# EAGLE design xv11_lidar_controller (EAGLE 7.3.0)

## Sheet 1 of 2: MAIN
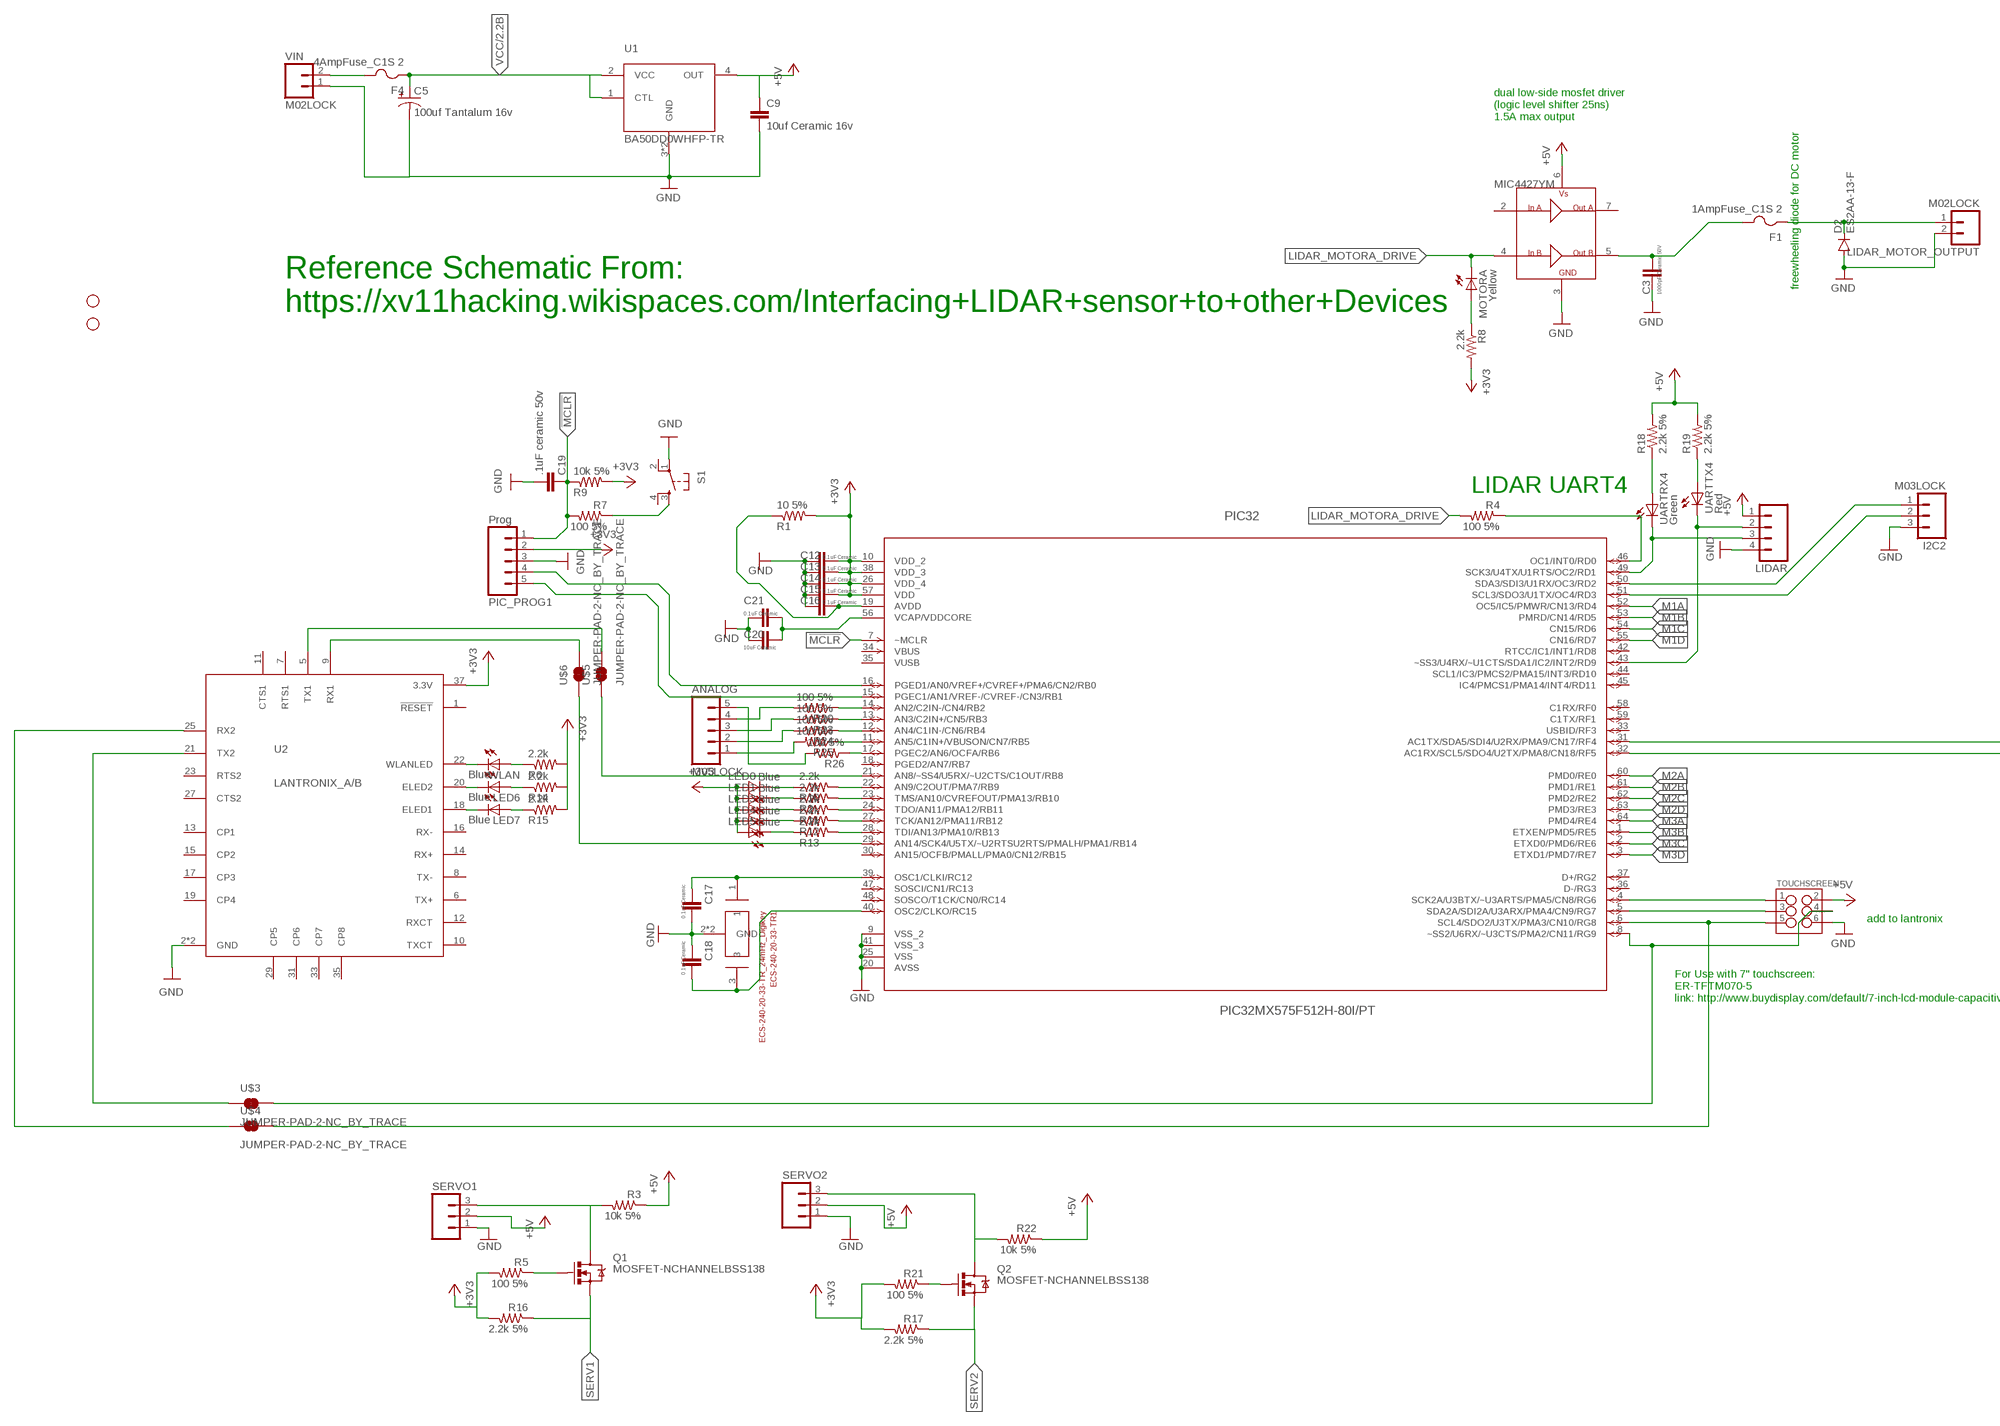
[diagram p0: schematic, sheet 1, part 1 of 2]
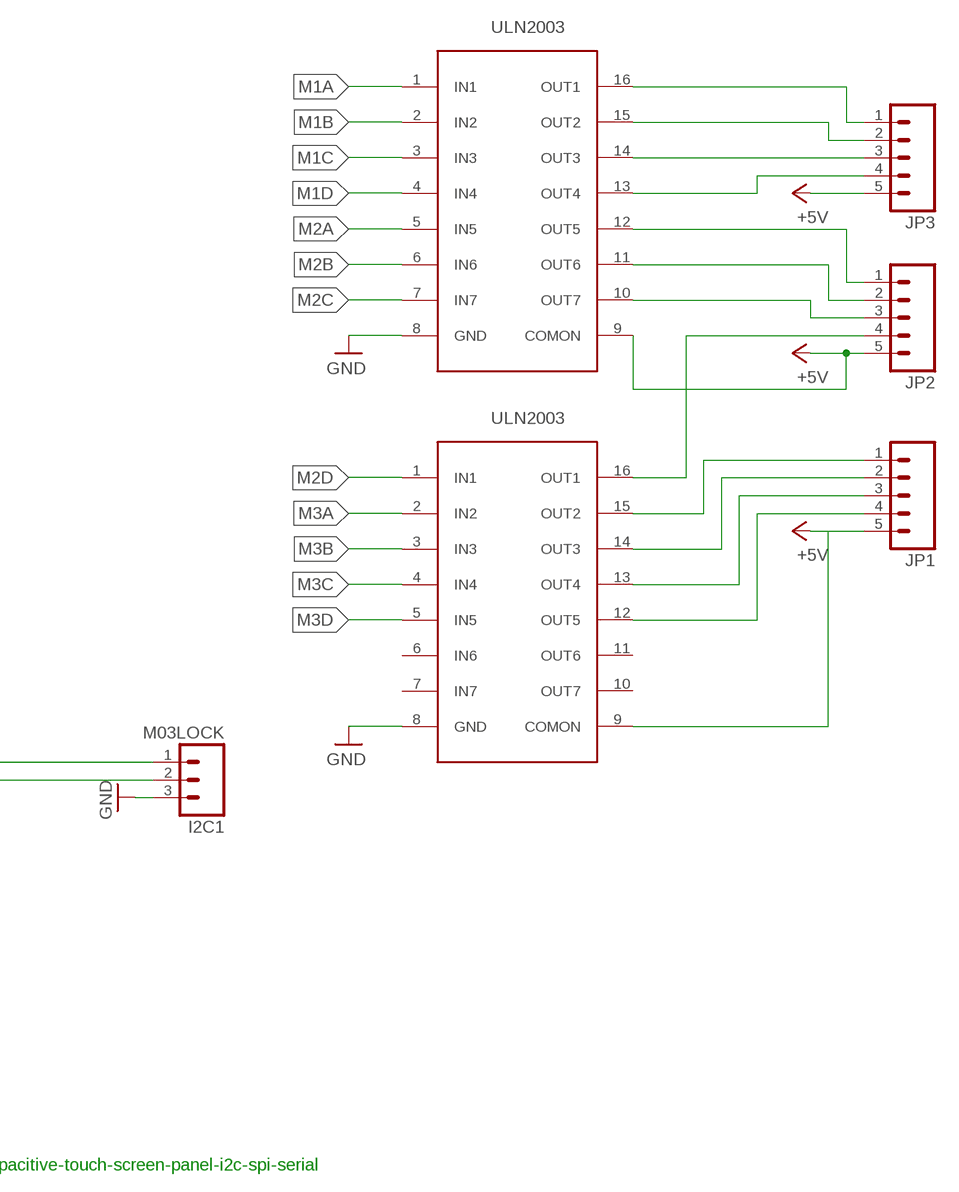
[diagram p1: schematic, sheet 1, part 2 of 2]

### Parts
ANALOG  M05LOCK  [1X05_LOCK]
C3  1000pF Ceramic 50V  CAP0805  [0805]
C5  100uf Tantalum 16v  CAP_POL1206  [EIA3216]
C9  10uf Ceramic 16v  CAP0805  [0805]
C12  0.1uF Ceramic  CAP0805  [0805]
C13  0.1uF Ceramic  CAP0805  [0805]
C14  0.1uF Ceramic  CAP0805  [0805]
C15  0.1uF Ceramic  CAP0805  [0805]
C16  0.1uF Ceramic  CAP0805  [0805]
C17  0.1uF Ceramic  CAP0805  [0805]
C18  0.1uF Ceramic  CAP0805  [0805]
C19  .1uF ceramic 50v  1UF-25V-10%(0805)  [0805]
C20  10uF Ceramic  CAP0805  [0805]
C21  0.1uF Ceramic  CAP0805  [0805]
D2  ES2AA-13-F  DIODESMA  [SMA-DIODE]
ECS-240-20-33-TR1  ECS-240-20-33-TR_24mHz_Digikey  CRYSTAL  [ECX-32]
F1  1AmpFuse_C1S 2  PTCFUSE-1206  [R1206]
F4  4AmpFuse_C1S 2  PTCFUSE-1206  [R1206]
I2C1  M03LOCK  [1X03_LOCK]
I2C2  M03LOCK  [1X03_LOCK]
JP1  M05LOCK  [1X05_LOCK]
JP2  M05LOCK  [1X05_LOCK]
JP3  M05LOCK  [1X05_LOCK]
LED0  Blue  LEDCHIP-LED0805  [CHIP-LED0805]
LED1  Blue  LEDCHIP-LED0805  [CHIP-LED0805]
LED3  Blue  LEDCHIP-LED0805  [CHIP-LED0805]
LED4  Blue  LEDCHIP-LED0805  [CHIP-LED0805]
LED5  Blue  LEDCHIP-LED0805  [CHIP-LED0805]
LED6  Blue  LEDCHIP-LED0805  [CHIP-LED0805]
LED7  Blue  LEDCHIP-LED0805  [CHIP-LED0805]
LIDAR  M04LOCK  [1X04_LOCK]
LIDAR_MOTOR_OUTPUT  M02LOCK  [1X02_LOCK]
MOTORA  Yellow  LEDCHIP-LED0805  [CHIP-LED0805]
PIC32  PIC32MX575F512H-80I/PT  [QFP50P1200X1200X120-64N]
PIC_PROG1  Prog  M05LOCK_LONGPADS  [1X05_LOCK_LONGPADS]
Q1  MOSFET-NCHANNELBSS138  [SOT23]
Q2  MOSFET-NCHANNELBSS138  [SOT23]
R1  10 5%  R-US_R0805  [R0805]
R2  2.2k  R-US_R0805  [R0805]
R3  10k 5%  R-US_R0805  [R0805]
R4  100 5%  R-US_M0805  [M0805]
R5  100 5%  R-US_R0805  [R0805]
R6  2.2k  R-US_R0805  [R0805]
R7  100 5%  R-US_R0805  [R0805]
R8  2.2k  R-US_M0805  [M0805]
R9  10k 5%  R-US_R0805  [R0805]
R10  2.2k  R-US_R0805  [R0805]
R11  2.2k  R-US_R0805  [R0805]
R12  2.2k  R-US_R0805  [R0805]
R13  2.2k  R-US_R0805  [R0805]
R14  2.2k  R-US_R0805  [R0805]
R15  2.2k  R-US_R0805  [R0805]
R16  2.2k 5%  R-US_R0805  [R0805]
R17  2.2k 5%  R-US_R0805  [R0805]
R18  2.2k 5%  R-US_M0805  [M0805]
R19  2.2k 5%  R-US_M0805  [M0805]
R20  100 5%  R-US_R0805  [R0805]
R21  100 5%  R-US_R0805  [R0805]
R22  10k 5%  R-US_R0805  [R0805]
R23  100 5%  R-US_R0805  [R0805]
R24  100 5%  R-US_R0805  [R0805]
R25  100 5%  R-US_R0805  [R0805]
R26  100 5%  R-US_R0805  [R0805]
S1  TAC_SWITCHSMD  [TACTILE-SWITCH-SMD]
SERVO1  M03PTH  [1X03]
SERVO2  M03PTH  [1X03]
STANDOFF1  STAND-OFF  [STAND-OFF]
STANDOFF2  STAND-OFF  [STAND-OFF]
TOUCHSCREEN  M03X2NO_SILK  [2X3-NS]
U1  BA50DD0WHFP-TR  [HRP5]
U2  LANTRONIX_A/B  [LANA/BTH]
U3  MIC4427YM  [SO-08]
U$1  ULN2003  [SOIC16_3.9WIDE]
U$2  ULN2003  [SOIC16_3.9WIDE]
U$3  JUMPER-PAD-2-NC_BY_TRACE  [PAD-JUMPER-2-NC_BY_TRACE_YES_SILK]
U$4  JUMPER-PAD-2-NC_BY_TRACE  [PAD-JUMPER-2-NC_BY_TRACE_YES_SILK]
U$5  JUMPER-PAD-2-NC_BY_TRACE  [PAD-JUMPER-2-NC_BY_TRACE_YES_SILK]
U$6  JUMPER-PAD-2-NC_BY_TRACE  [PAD-JUMPER-2-NC_BY_TRACE_YES_SILK]
UARTRX4  Green  LEDCHIP-LED0805  [CHIP-LED0805]
UARTTX4  Red  LEDCHIP-LED0805  [CHIP-LED0805]
VIN  M02LOCK  [1X02_LOCK]
WLAN  Blue  LEDCHIP-LED0805  [CHIP-LED0805]

### Nets
!MCLR: C19.1 PIC32.7(~MCLR) PIC_PROG1.1 R7.2 R9.1
+3V3: C12.2 C13.2 C14.2 C15.2 LED0.A LED1.A LED3.A LED4.A LED5.A PIC32.10(VDD_2) PIC32.26(VDD_4) PIC32.38(VDD_3) PIC32.57(VDD) PIC_PROG1.2 R1.2 R5.2 R6.2 R8.2 R9.2 R14.2 R15.2 R16.2 R17.2 R21.2 U2.37(3.3V) ; also sheet 2
+5V: C9.1 JP1.5 JP2.5 JP3.5 LIDAR.1 R3.1 R18.2 R19.2 R22.1 SERVO1.2 SERVO2.2 TOUCHSCREEN.2 U1.4(OUT) U3.6(VS) U$1.9(COMON) U$2.9(COMON)
GND: C3.1 C5.C(-) C9.2 C12.1 C13.1 C14.1 C15.1 C16.1 C17.2 C18.1 C19.2 C20.1 C21.1 D2.A ECS-240-20-33-TR1.2(GND) ECS-240-20-33-TR1.4(GND) I2C1.3 I2C2.3 LIDAR.4 LIDAR_MOTOR_OUTPUT.2 PIC32.9(VSS_2) PIC32.20(AVSS) PIC32.25(VSS) PIC32.41(VSS_3) PIC_PROG1.3 S1.1 SERVO1.1 SERVO2.1 TOUCHSCREEN.6 U1.3(GND) U1.G(GND) U2.2(GND) U2.39(GND) U3.3(GND) U$1.8(GND) U$2.8(GND) VIN.1 ; also sheet 2
LIDAR_MOTOR_OUTPUT: D2.C F1.1 LIDAR_MOTOR_OUTPUT.1
LIDAR_MOTORA_DRIVE: MOTORA.C R4.2 U3.4(INB)
M1A: PIC32.52(OC5/IC5/PMWR/CN13/RD4) U$1.1(IN1)
M1B: PIC32.53(PMRD/CN14/RD5) U$1.2(IN2)
M1C: PIC32.54(CN15/RD6) U$1.3(IN3)
M1D: PIC32.55(CN16/RD7) U$1.4(IN4)
M2A: PIC32.60(PMD0/RE0) U$1.5(IN5)
M2B: PIC32.61(PMD1/RE1) U$1.6(IN6)
M2C: PIC32.62(PMD2/RE2) U$1.7(IN7)
M2D: PIC32.63(PMD3/RE3) U$2.1(IN1)
M3A: PIC32.64(PMD4/RE4) U$2.2(IN2)
M3B: PIC32.1(ETXEN/PMD5/RE5) U$2.3(IN3)
M3C: PIC32.2(ETXD0/PMD6/RE6) U$2.4(IN4)
M3D: PIC32.3(ETXD1/PMD7/RE7) U$2.5(IN5)
N1: PIC32.22(AN9/C2OUT/PMA7/RB9) R10.2
N2: PIC32.23(TMS/AN10/CVREFOUT/PMA13/RB10) R2.2
N$1: U2.25(RX2) U$4.1
N$2: ANALOG.1 R25.2
N$3: ANALOG.2 R24.2
N$4: C3.2 F1.2 U3.5(OUTB)
N$5: PIC32.46(OC1/INT0/RD0) R4.1
N$6: PIC32.14(AN2/C2IN-/CN4/RB2) R20.1
N$7: U2.21(TX2) U$3.1
N$8: R18.1 UARTRX4.A
N$9: ANALOG.3 R23.2
N$10: PIC32.13(AN3/C2IN+/CN5/RB3) R23.1
N$11: C17.1 ECS-240-20-33-TR1.1 PIC32.39(OSC1/CLKI/RC12)
N$12: C18.2 ECS-240-20-33-TR1.3 PIC32.40(OSC2/CLKO/RC15)
N$13: PIC32.12(AN4/C1IN-/CN6/RB4) R24.1
N$14: PIC32.11(AN5/C1IN+/VBUSON/CN7/RB5) R25.1
N$15: ANALOG.4 R20.2
N$16: C16.2 PIC32.19(AVDD) R1.1
N$17: C20.2 C21.2 PIC32.56(VCAP/VDDCORE)
N$18: Q1.3(D) R3.2 SERVO1.3
N$19: PIC32.16(PGED1/AN0/VREF+/CVREF+/PMA6/CN2/RB0) PIC_PROG1.4
N$20: LED0.C R10.1
N$21: PIC32.8(~SS2/U6RX/~U3CTS/PMA2/CN11/RG9) TOUCHSCREEN.4 U$3.2
N$22: LED1.C R2.1
N$23: R7.1 S1.3
N$24: LED3.C R11.1
N$25: Q2.3(D) R22.2 SERVO2.3
N$26: Q1.1(G) R5.1
N$27: Q2.1(G) R21.1
N$29: LIDAR.3 PIC32.49(SCK3/U4TX/U1RTS/OC2/RD1) UARTRX4.C
N$30: LIDAR.2 PIC32.43(~SS3/U4RX/~U1CTS/SDA1/IC2/INT2/RD9) UARTTX4.C
N$31: MOTORA.A R8.1
N$33: PIC32.24(TDO/AN11/PMA12/RB11) R11.2
N$36: PIC32.17(PGEC2/AN6/OCFA/RB6) R26.1
N$37: ANALOG.5 R26.2
N$39: U2.9(RX1) U$6.2
N$40: PIC32.21(AN8/~SS4/U5RX/~U2CTS/C1OUT/RB8) U$5.1
N$43: R19.1 UARTTX4.A
N$48: F4.2 VIN.2
N$51: JP3.1 U$1.16(OUT1)
N$52: JP3.2 U$1.15(OUT2)
N$53: JP3.3 U$1.14(OUT3)
N$54: JP3.4 U$1.13(OUT4)
N$55: JP2.1 U$1.12(OUT5)
N$56: JP2.2 U$1.11(OUT6)
N$57: JP2.3 U$1.10(OUT7)
N$58: JP2.4 U$2.16(OUT1)
N$59: JP1.1 U$2.15(OUT2)
N$60: JP1.2 U$2.14(OUT3)
N$61: JP1.3 U$2.13(OUT4)
N$62: JP1.4 U$2.12(OUT5)
N$63: U2.5(TX1) U$5.2
N$64: I2C2.1 PIC32.50(SDA3/SDI3/U1RX/OC3/RD2)
N$65: I2C2.2 PIC32.51(SCL3/SDO3/U1TX/OC4/RD3)
N$66: PIC32.29(AN14/SCK4/U5TX/~U2RTSU2RTS/PMALH/PMA1/RB14) U$6.1
N$67: U2.22(WLANLED) WLAN.C
N$68: LED6.C U2.20(ELED2)
N$69: LED7.C U2.18(ELED1)
N$70: LED7.A R15.1
N$71: LED6.A R14.1
N$72: R6.1 WLAN.A
ONE: LED5.C R13.1
PIC_HANG_CHK: PIC32.15(PGEC1/AN1/VREF-/CVREF-/CN3/RB1) PIC_PROG1.5
PICUART_RX: I2C1.1 PIC32.31(AC1TX/SDA5/SDI4/U2RX/PMA9/CN17/RF4)
PICUART_TX: I2C1.2 PIC32.32(AC1RX/SCL5/SDO4/U2TX/PMA8/CN18/RF5)
SCK2: PIC32.4(SCK2A/U3BTX/~U3ARTS/PMA5/CN8/RG6) TOUCHSCREEN.1
SDI2: PIC32.5(SDA2A/SDI2A/U3ARX/PMA4/CN9/RG7) TOUCHSCREEN.3
SDO2: PIC32.6(SCL4/SDO2/U3TX/PMA3/CN10/RG8) TOUCHSCREEN.5 U$4.2
SERV1: PIC32.28(TDI/AN13/PMA10/RB13) Q1.2(S) R13.2 R16.1
SERV2: PIC32.27(TCK/AN12/PMA11/RB12) Q2.2(S) R12.2 R17.1
TWO: LED4.C R12.1
VCC: C5.A(+) F4.1 U1.1(CTL) U1.2(VCC) ; also sheet 2
Unconnected: PIC32.18(PGED2/AN7/RB7) PIC32.30(AN15/OCFB/PMALL/PMA0/CN12/RB15) PIC32.33(USBID/RF3) PIC32.34(VBUS) PIC32.36(D-/RG3) PIC32.37(D+/RG2) PIC32.42(RTCC/IC1/INT1/RD8) PIC32.44(SCL1/IC3/PMCS2/PMA15/INT3/RD10) PIC32.45(IC4/PMCS1/PMA14/INT4/RD11) PIC32.47(SOSCI/CN1/RC13) PIC32.48(SOSCO/T1CK/CN0/RC14) PIC32.58(C1RX/RF0) PIC32.59(C1TX/RF1) S1.2 S1.4 U2.1(!RESET) U2.6(TX+) U2.7(RTS1) U2.8(TX-) U2.10(TXCT) U2.11(CTS1) U2.12(RXCT) U2.13(CP1) U2.14(RX+) U2.15(CP2) U2.16(RX-) U2.17(CP3) U2.19(CP4) U2.23(RTS2) U2.27(CTS2) U2.29(CP5) U2.31(CP6) U2.33(CP7) U2.35(CP8) U3.2(INA) U3.7(OUTA) U$2.6(IN6) U$2.7(IN7) U$2.10(OUT7) U$2.11(OUT6)

### Notes on the sheet
- dual low-side mosfet driver
  (logic level shifter 25ns)
  1.5A max output
- freewheeling diode for DC motor
- Reference Schematic From:
  https://xv11hacking.wikispaces.com/Interfacing+LIDAR+sensor+to+other+Devices
- LIDAR UART4
- add to lantronix
- For Use with 7" touchscreen:
  ER-TFTM070-5
  link: http://www.buydisplay.com/default/7-inch-lcd-module-capacitive-touch-screen-panel-i2c-spi-serial

## Sheet 2 of 2: POWER
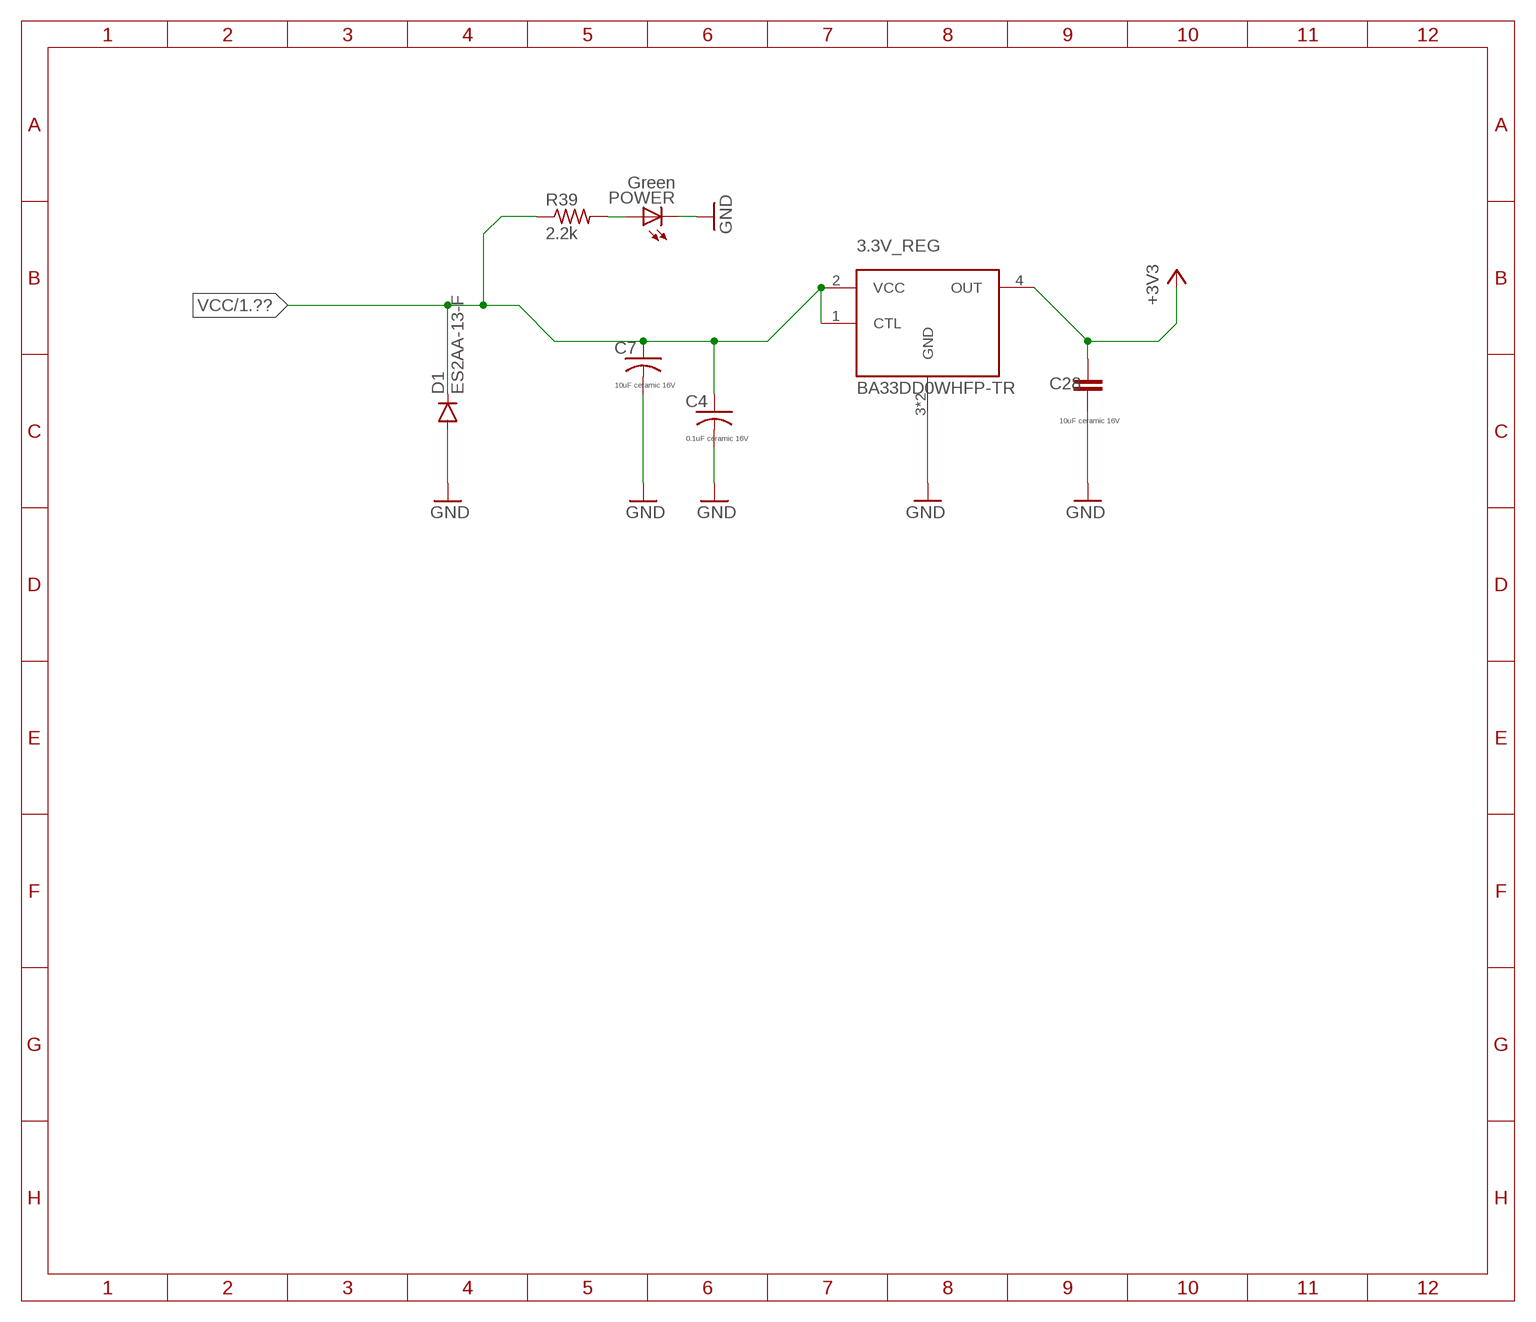
[diagram p2: schematic, sheet 2]

### Parts
3.3V_REG  BA33DD0WHFP-TR  BA50DD0WHFP-TR  [HRP5]
C4  0.1uF ceramic 16V  C-USC0805K  [C0805K]
C7  10uF ceramic 16V  C-USC0805K  [C0805K]
C28  10uF ceramic 16V  CAP0805  [0805]
D1  ES2AA-13-F  DIODESMA  [SMA-DIODE]
POWER  Green  LEDCHIP-LED0805  [CHIP-LED0805]
R39  2.2k  R-US_R0805  [R0805]

### Nets
+3V3: 3.3V_REG.4(OUT) C28.1 ; also sheet 1
GND: 3.3V_REG.3(GND) 3.3V_REG.G(GND) C4.2 C7.2 C28.2 D1.A POWER.C ; also sheet 1
N$50: POWER.A R39.2
VCC: 3.3V_REG.1(CTL) 3.3V_REG.2(VCC) C4.1 C7.1 D1.C R39.1 ; also sheet 1

## Power pins joined to a net without a drawn wire
VUSB: PIC32.35(VUSB)

## Library data of the parts
3.3V_REG U1 = NASA_LIB:BA50DD0WHFP-TR
ANALOG JP1-JP3 PIC_PROG1 = SparkFun-Connectors:M05: Header 5 Standard 5-pin 0.1" header. Use with straight break away headers (SKU : PRT-00116), right angle break away headers (PRT-00553), swiss pins (PRT-00743), machine pins (PRT-00117), and female headers (PRT-00115). Molex polarized connector foot print use with SKU : PRT-08230 with associated crimp pins and housings.
C3 C9 C12-C18 C20 C21 C28 = SparkFun-Capacitors:CAP: Capacitor Standard 0603 ceramic capacitor, and 0.1" leaded capacitor.
C4 C7 = adafruit:C-US: CAPACITOR, American symbol
C5 = SparkFun-Capacitors:CAP_POL: Capacitor Polarized These are standard SMD and PTH capacitors. Normally 10uF, 47uF, and 100uF in electrolytic and tantalum varieties. Always verify the external diameter of the through hole cap, it varies with capacity, voltage, and manufacturer. The EIA devices should be standard.
C19 = SparkFun-Capacitors:1UF-25V-10%(0805): CAP-08064; PROD_ID: CAP-08064; VALUE: 1uF
D1 D2 = SparkFun-DiscreteSemi:DIODE: Diode These are standard reverse protection diodes and small signal diodes. SMA package can handle up to about 1A. SOD-323 can handle about 200mA. What the SOD-323 package when ordering, there are some mfgs out there that are 5-pin packages.
ECS-240-20-33-TR1 = Crystal ECS:CRYSTAL
F1 F4 = adafruit:PTCFUSE: PTC fuses, resettable thermistors
I2C1 I2C2 SERVO1 SERVO2 = SparkFun-Connectors:M03: Header 3 Standard 3-pin 0.1" header. Use with straight break away headers (SKU : PRT-00116), right angle break away headers (PRT-00553), swiss pins (PRT-00743), machine pins (PRT-00117), and female headers (PRT-00115). Molex polarized connector foot print use with SKU : PRT-08232 with associated crimp pins and housings.
LED0 LED1 LED3-LED7 MOTORA POWER UARTRX4 UARTTX4 WLAN = adafruit:LED: LED OSRAM: - CHIPLED LG R971, LG N971, LY N971, LG Q971, LY Q971, LO R971, LY R971 LH N974, LH R974 LS Q976, LO Q976, LY Q976 LO Q996 - Hyper CHIPLED LW Q18S LB Q993, LB Q99A, LB R99A - SideLED LS A670, LO A670, LY A670, LG A670, LP A670 LB A673, LV A673, LT A673, LW A673 LH A674 LY A675 LS A676, LA A676, LO A676, LY A676, LW A676 LS A679, LY A679, LG A679 - Hyper Micro SIDELED® LS Y876, LA Y876, LO Y876, LY Y876 LT Y87S - SmartLED LW L88C, LW L88S LB L89C, LB L89S, LG L890 LS L89K, LO L89K, LY L89K LS L896, LA L896, LO L896, LY L896 - TOPLED LS T670, LO T670, LY T670, LG T670, LP T670 LSG T670, LSP T670, LSY T670, LOP T670, LYG T670 LG T671, LOG T671, LSG T671 LB T673, LV T673, LT T673, LW T673 LH T674 LS T676, LA T676, LO T676, LY T676, LB T676, LH T676, LSB T676, LW T676 LB T67C, LV T67C, LT T67C, LS T67K, LO T67K, LY T67K, LW E67C LS E67B, LA E67B, LO E67B, LY E67B, LB E67C, LV E67C, LT E67C LW T67C LS T679, LY T679, LG T679 LS T770, LO T770, LY T770, LG T770, LP T770 LB T773, LV T773, LT T773, LW T773 LH T774 LS E675, LA E675, LY E675, LS T675 LS T776, LA T776, LO T776, LY T776, LB T776 LHGB T686 LT T68C, LB T68C - Hyper Mini TOPLED® LB M676 - Mini TOPLED Santana® LG M470 LS M47K, LO M47K, LY M47K Source: http://www.osram.convergy.de/
LIDAR = SparkFun-Connectors:M04: Header 4 Standard 4-pin 0.1" header. Use with straight break away headers (SKU : PRT-00116), right angle break away headers (PRT-00553), swiss pins (PRT-00743), machine pins (PRT-00117), and female headers (PRT-00115). Molex polarized connector foot print use with SKU : PRT-08231 with associated crimp pins and housings. 1MM SMD Version SKU: PRT-10208
LIDAR_MOTOR_OUTPUT VIN = SparkFun-Connectors:M02: Standard 2-pin 0.1" header. Use with - straight break away headers ( PRT-00116) - right angle break away headers (PRT-00553) - swiss pins (PRT-00743) - machine pins (PRT-00117) - female headers (PRT-00115) Molex polarized connector foot print use with: PRT-08233 with associated crimp pins and housings. 2.54_SCREWTERM for use with PRT-10571. 3.5mm Screw Terminal footprints for PRT-08084 5mm Screw Terminal footprints for use with PRT-08433
PIC32 = Microchip_By_element14_Batch_1:PIC32MX575F512H-80I/PT: IC, 32BIT MCU; DESCRIPTION: IC MCU; MPN: PIC32MX675F512H-80I/PT; OC_FARNELL: 1778969; OC_NEWARK: 25R8399; PACKAGE: TQFP-64; SUPPLIER: Microchip
Q1 Q2 = SparkFun-DiscreteSemi:MOSFET-NCHANNEL: Common NMOSFET Parts MFG P/N Store ID Prod ID FDD8780 TRANS-09984 SI7820DN TRANS-11055 FDS6630A IC-08089 2N7002PW TRANS-11151 FQP30N06L COM-10213 TRANS-10060 BSS123LT1G TRANS-08345 BSS138 TRANS-00830 BS170 2N7000; PROD_ID: TRANS-00830
R1-R26 R39 = adafruit:R-US_: RESISTOR, American symbol
S1 = SparkFun-Electromechanical:TAC_SWITCH: Momentary Switch Button commonly used for reset or general input. Spark Fun Electronics SKU : COM-00097 SMT- SWCH-08247
STANDOFF1 STANDOFF2 = SparkFun-Electromechanical:STAND-OFF: #4 Stand Off This is the mechanical footprint for a #4 phillips button head screw. Use the keepout ring to avoid running the screw head into surrounding components. SKU : PRT-00447
TOUCHSCREEN = SparkFun-Connectors:M03X2: 2x3 .1" header. Shrouded, with keying- CONN-10681 SMT- CONN-11415 Pogo pins- HW-11044
U2 = NASA_LIB:LANTRONIX_A/B
U3 = transistor-power:MIC4427YM
U$1 U$2 = NASA_LIB:ULN2003
U$3-U$6 = SparkFun-Passives:JUMPER-PAD-2-NC_BY_TRACE

## Board
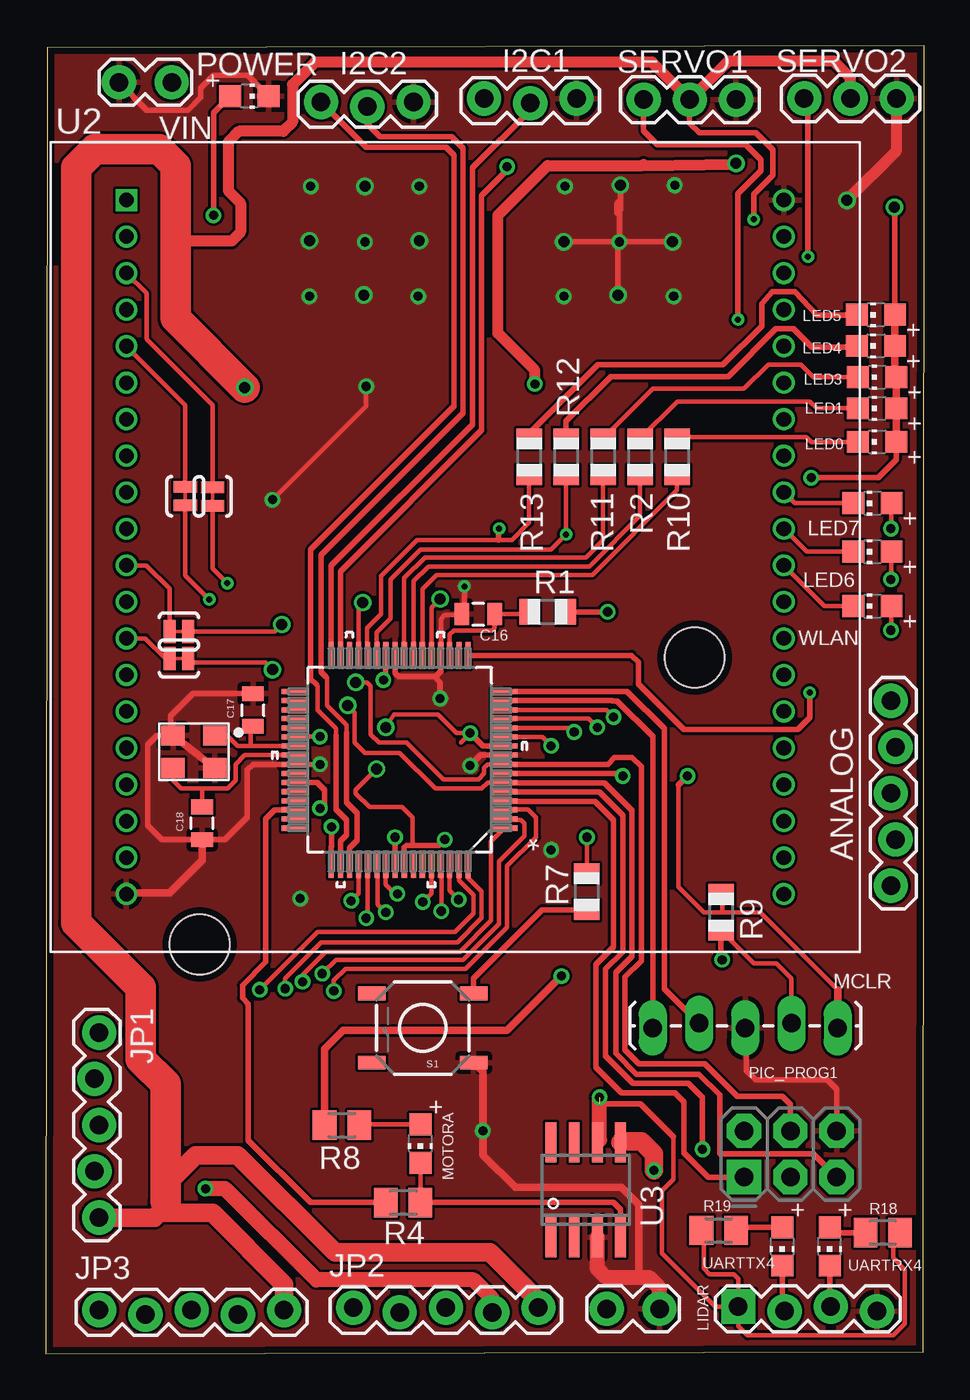
[diagram p3: board, top side]
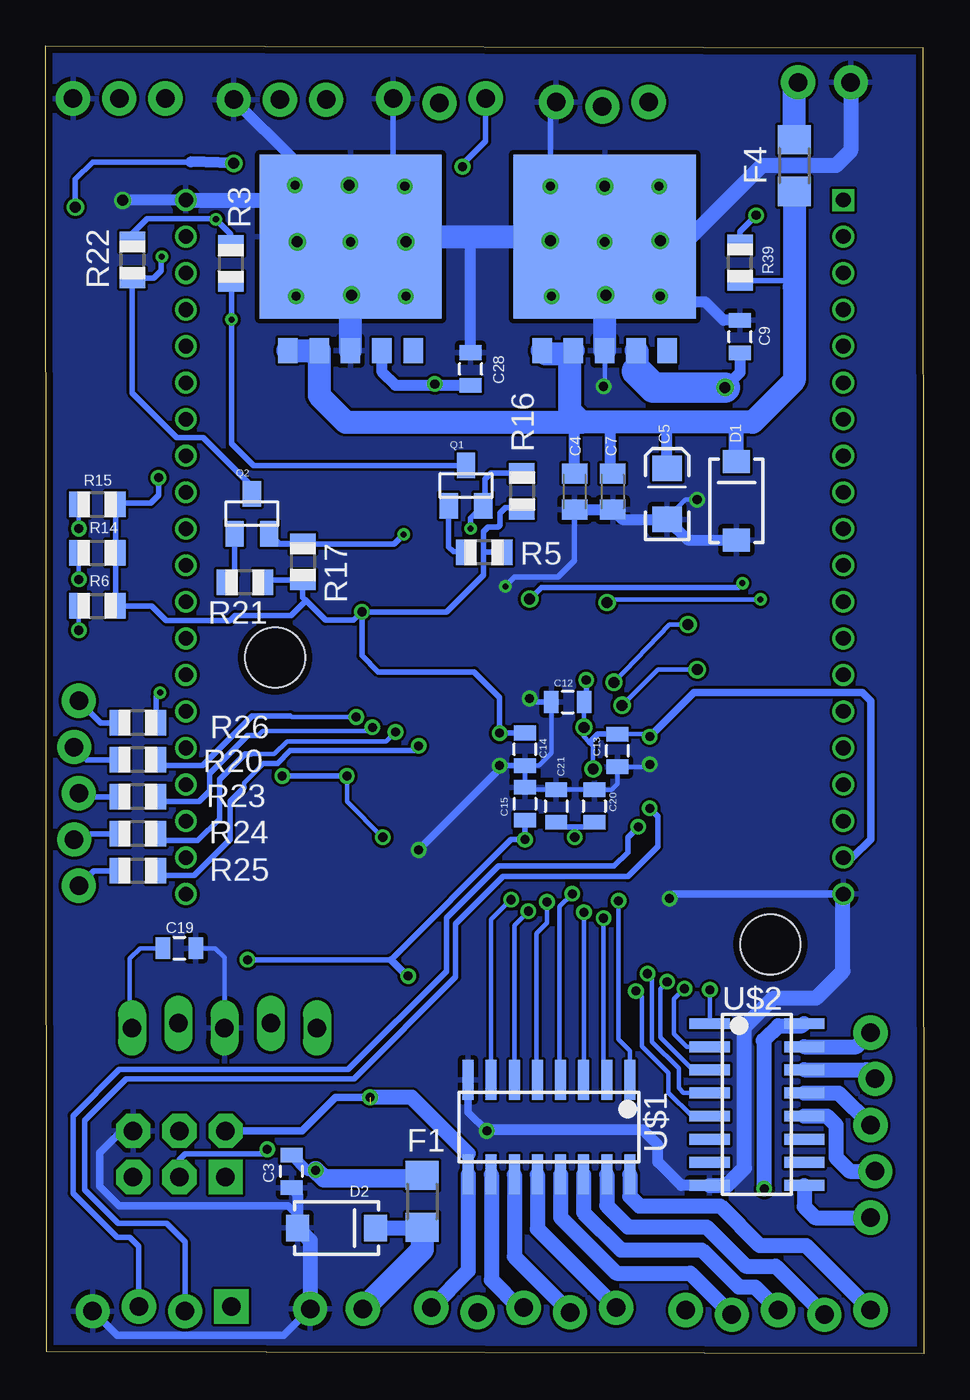
[diagram p4: board, bottom side, seen from below]

Size 48.25 x 71.87 mm. Coordinates in mm from the lower left corner, seen from the top.
Outline: 0,0 48.18,0.13 48.25,71.87 0.06,71.75 0,0
Copper layers (1*16): Top 0.0356mm / dielectric 1.5011mm / Bottom 0.0356mm
Design rules "OHS": minimum track width 6mil, minimum drill 13mil, track to track 6mil, track to pad 6mil, pad to pad 6mil, via to via 6mil, smd to smd 6mil, copper to edge 15mil, drill to drill 6mil, minimum pad ring 7mil, minimum via ring 7mil, stop-mask expansion 4mil, vias tented up to drill 0mil, thermal gap 10mil

### Footprints (pad centres in the part's own frame; a part is rotated, then mirrored left to right if it is on the bottom)
HRP5 = smd 1.07 x 1.37: 1 -3.44,0; 2 -1.72,0; 3 0,0; 4 1.72,0; 5 3.44,0 | smd 10 x 9: G 0,6.254
1X05_LOCK = drill 1.016 pad 1.88: 1 0,0.127; 2 2.54,-0.127; 3 5.08,0.127; 4 7.62,-0.127; 5 10.16,0.127
0805 = smd 0.8 x 1.2: 1 -0.9,0; 2 0.9,0
C0805K = smd 1.1 x 1.4: 1 -1,0; 2 1,0
EIA3216 = smd 1.4 x 1.6: A 1.4,0; C -1.4,0
SMA-DIODE = smd 1.27 x 1.47: A -2.15,0; C 2.15,0
ECX-32 = smd 1.3 x 1.1: 1 -1.15,-0.9; 2 1.15,-0.9; 3 1.15,0.9; 4 -1.15,0.9
R1206 = smd 1.6 x 1.803: 1 -1.422,0; 2 1.422,0
1X03_LOCK = drill 1.016 pad 1.88: 1 0,0.127; 2 2.54,-0.127; 3 5.08,0.127
CHIP-LED0805 = smd 1.2 x 1.2: A 0,-1.05; C 0,1.05
1X04_LOCK = drill 1.016 pad 1.88 square: 1 0,0.127 | drill 1.016 pad 1.88: 2 2.54,-0.127; 3 5.08,0.127; 4 7.62,-0.127
1X02_LOCK = drill 1.016 pad 1.88: 1 -0.178,0; 2 2.718,0
QFP50P1200X1200X120-64N = smd 1.473 x 0.279: 1 -5.74,3.759; 2 -5.74,3.251; 3 -5.74,2.743; 4 -5.74,2.261; 5 -5.74,1.753; 6 -5.74,1.245; 7 -5.74,0.762; 8 -5.74,0.254; 9 -5.74,-0.254; 10 -5.74,-0.762; 11 -5.74,-1.245; 12 -5.74,-1.753; 13 -5.74,-2.261; 14 -5.74,-2.743; 15 -5.74,-3.251; 16 -5.74,-3.759; 33 5.74,-3.759; 34 5.74,-3.251; 35 5.74,-2.743; 36 5.74,-2.261; 37 5.74,-1.753; 38 5.74,-1.245; 39 5.74,-0.762; 40 5.74,-0.254; 41 5.74,0.254; 42 5.74,0.762; 43 5.74,1.245; 44 5.74,1.753; 45 5.74,2.261; 46 5.74,2.743; 47 5.74,3.251; 48 5.74,3.759 | smd 0.279 x 1.473: 17 -3.759,-5.74; 18 -3.251,-5.74; 19 -2.743,-5.74; 20 -2.261,-5.74; 21 -1.753,-5.74; 22 -1.245,-5.74; 23 -0.762,-5.74; 24 -0.254,-5.74; 25 0.254,-5.74; 26 0.762,-5.74; 27 1.245,-5.74; 28 1.753,-5.74; 29 2.261,-5.74; 30 2.743,-5.74; 31 3.251,-5.74; 32 3.759,-5.74; 49 3.759,5.74; 50 3.251,5.74; 51 2.743,5.74; 52 2.261,5.74; 53 1.753,5.74; 54 1.245,5.74; 55 0.762,5.74; 56 0.254,5.74; 57 -0.254,5.74; 58 -0.762,5.74; 59 -1.245,5.74; 60 -1.753,5.74; 61 -2.261,5.74; 62 -2.743,5.74; 63 -3.251,5.74; 64 -3.759,5.74
1X05_LOCK_LONGPADS = drill 1.016 long: 1 0,0; 2 2.54,-0.254; 3 5.08,0; 4 7.62,-0.254; 5 10.16,0
SOT23 = smd 1 x 1.4: 1 -0.95,-1.1; 2 0.95,-1.1; 3 0,1.1
R0805 = smd 1.1 x 1.4: 1 -1,0; 2 1,0
M0805 = smd 1.3 x 1.6: 1 -0.95,0; 2 0.95,0
TACTILE-SWITCH-SMD = smd 1.524 x 0.762: 1 -2.794,1.905; 2 2.794,1.905; 3 -2.794,-1.905; 4 2.794,-1.905
1X03 = drill 1.016 pad 1.88: 1 0,0; 2 2.54,0; 3 5.08,0
STAND-OFF = hole 3.302: 0,0
2X3-NS = drill 1.016 pad 1.88 square: 1 -2.54,-1.27 | drill 1.016 pad 1.88 octagon: 2 -2.54,1.27; 3 0,-1.27; 4 0,1.27; 5 2.54,-1.27; 6 2.54,1.27
LANA/BTH = drill 0.8 square: 1 -18.059,19.063 | drill 0.8: 2 18.059,19.063; 3 -18.059,17.056; 4 18.059,17.056; 5 -18.059,15.05; 6 18.059,15.05; 7 -18.059,13.043; 8 18.059,13.043; 9 -18.059,11.036; 10 18.059,11.036; 11 -18.059,9.03; 12 18.059,9.03; 13 -18.059,7.023; 14 18.059,7.023; 15 -18.059,5.016; 16 18.059,5.016; 17 -18.059,3.01; 18 18.059,3.01; 19 -18.059,1.003; 20 18.059,1.003; 21 -18.059,-1.003; 22 18.059,-1.003; 23 -18.059,-3.01; 24 18.059,-3.01; 25 -18.059,-5.016; 26 18.059,-5.016; 27 -18.059,-7.023; 28 18.059,-7.023; 29 -18.059,-9.03; 30 18.059,-9.03; 31 -18.059,-11.036; 32 18.059,-11.036; 33 -18.059,-13.043; 34 18.059,-13.043; 35 -18.059,-15.05; 36 18.059,-15.05; 37 -18.059,-17.056; 38 18.059,-17.056; 39 -18.059,-19.063; 40 18.059,-19.063
SO-08 = smd 0.6 x 2.2: 1 -1.905,-2.6; 2 -0.635,-2.6; 3 0.635,-2.6; 4 1.905,-2.6; 5 1.905,2.6; 6 0.635,2.6; 7 -0.635,2.6; 8 -1.905,2.6
SOIC16_3.9WIDE = smd 0.6 x 2.2: 1 -4.431,-2.746; 2 -3.161,-2.746; 3 -1.891,-2.746; 4 -0.621,-2.746; 5 0.649,-2.746; 6 1.919,-2.746; 7 3.189,-2.746; 8 4.459,-2.746; 9 4.459,2.454; 10 3.189,2.454; 11 1.919,2.454; 12 0.649,2.454; 13 -0.621,2.454; 14 -1.891,2.454; 15 -3.161,2.454; 16 -4.431,2.454
PAD-JUMPER-2-NC_BY_TRACE_YES_SILK = smd 0.635 x 1.27: 1 -0.508,0; 2 0.508,0

### Placement (x,y rotation side)
3.3V_REG  31.5,55.12 0 bottom
ANALOG  46.55,25.72 90 top
C3  34.73,10.03 90 bottom
C4  19.18,47.37 270 bottom
C5  14.1,47.24 90 bottom
C7  17.08,47.37 270 bottom
C9  10.1,55.88 90 bottom
C12  19.56,35.81 0 bottom
C13  16.83,33.15 90 bottom
C14  21.91,33.21 90 bottom
C15  21.91,30.23 270 bottom
C16  23.75,40.64 0 top
C17  11.37,35.37 90 top
C18  8.57,29.15 90 top
C19  40.89,22.29 0 bottom
C20  18.1,30.1 270 bottom
C21  20.19,30.1 270 bottom
C28  24.89,54.1 90 bottom
D1  10.29,46.86 90 bottom
D2  32.26,6.92 0 bottom
ECS-240-20-33-TR1  8.13,33.08 180 top
F1  27.56,8.38 90 bottom
F4  7.11,65.28 90 bottom
I2C1  24.07,68.83 0 top
I2C2  15.11,68.64 0 top
JP1  2.79,17.65 270 top
JP2  16.89,2.41 0 top
JP3  2.92,2.29 0 top
LED0  45.66,50.1 90 top
LED1  45.66,51.94 90 top
LED3  45.66,53.66 90 top
LED4  45.59,55.37 90 top
LED5  45.59,57.09 90 top
LED6  45.4,44.07 90 top
LED7  45.4,46.74 90 top
LIDAR  38.04,2.48 0 top
LIDAR_MOTOR_OUTPUT  30.99,2.48 0 top
MOTORA  20.57,11.56 180 top
PIC32  19.43,32.64 180 top
PIC_PROG1  43.5,17.91 180 top
POWER  11.18,69.09 270 top
Q1  25.15,47.7 0 bottom
Q2  36.91,46.15 0 bottom
R1  27.56,40.77 0 top
R2  32.64,49.28 270 top
R3  38.07,59.89 270 bottom
R4  19.62,8.32 0 top
R5  24.16,44.04 0 bottom
R6  45.4,41.08 0 bottom
R7  29.72,25.4 90 top
R8  16.26,12.57 180 top
R9  37.08,24.26 270 top
R10  34.67,49.28 270 top
R11  30.61,49.28 270 top
R12  28.57,49.28 270 top
R13  26.54,49.28 270 top
R14  45.4,44.01 0 bottom
R15  45.4,46.67 0 bottom
R16  22.07,47.4 270 bottom
R17  34.11,43.51 270 bottom
R18  45.97,6.67 0 top
R19  36.96,6.79 180 top
R20  43.18,32.64 180 bottom
R21  37.29,42.39 0 bottom
R22  43.48,60.1 270 bottom
R23  43.18,30.61 180 bottom
R24  43.18,28.57 180 bottom
R25  43.18,26.54 180 bottom
R26  43.18,34.67 180 bottom
R39  10.1,59.94 90 bottom
S1  20.7,17.91 180 top
SERVO1  37.91,68.9 180 top
SERVO2  46.74,68.96 180 top
STANDOFF1  8.43,22.5 0 top
STANDOFF2  35.64,38.25 0 top
TOUCHSCREEN  40.89,10.99 0 top
U1  17.53,55.12 0 bottom
U2  22.48,44.32 0 top
U3  29.65,9.02 0 top
U$1  20.57,12.32 180 bottom
U$2  9.02,13.72 270 bottom
U$3  7.3,39.69 0 top
U$4  7.3,38.2 0 top
U$5  9.16,47.1 90 top
U$6  7.66,47.12 90 top
UARTRX4  43.05,5.91 180 top
UARTTX4  40.45,5.91 180 top
VIN  4.19,69.85 0 top
WLAN  45.4,41.08 90 top

### Tracks (layer width: path | path; a pad name or v marks a point on that pad's centre or on a via)
!MCLR  (via drill 0.5)
  Top 0.254: R7.2 v29.72,28.38 | 43.5,20 39.24,24.26 37.15,24.26 | 37.15,24.26 36.13,24.26 34.73,25.65 34.73,31.24 | R9.1 37.15,25.19 37.15,24.26
  Top 0.305: 34.73,31.24 v35.24,31.75 | v31.69,31.75 31.56,31.88 PIC32.7
  Top 0.406: PIC_PROG1.1 43.5,20
  Bottom 0.254: v29.72,28.38 31.69,30.35 v31.69,31.75 | C19.1 43.05,22.29 43.62,21.72 43.62,19.24 PIC_PROG1.1
  Bottom 0.305: v35.24,31.75 v31.69,31.75
+3V3  (via drill 0.5, 0.6)
  Top 0.254: R9.2 38.88,21.46 40.13,21.46 40.96,20.64 PIC_PROG1.2 | PIC32.38 13.72,33.91 v15.05,33.91 | 22.8,33.59 v23.3,34.1 22.54,34.1 21.53,35.12 19.11,35.12 v18.67,34.42 | 20.26,27.94 20.13,28.07 20.13,29.46 19.56,30.04 17.78,30.04 17.02,30.8 17.02,30.99 v18.16,32.13
  Top 0.305: PIC32.57 19.68,27.81 19.81,27.94 20.26,27.94 21.59,27.94 v21.91,28.26 21.65,28 | PIC32.10 24,33.4 v23.3,34.1 | PIC32.26 18.67,37.15 v18.54,37.02 | R9.2 37.08,21.72 v37.15,21.65 | R1.2 v30.86,40.77 | LED0.A 46.71,49.12 45.72,48.13 v42.04,48.13 | LED5.A 46.64,62.96 v46.61,62.99
  Top 0.406: LED0.A LED1.A LED3.A 46.64,53.72 LED4.A LED5.A 46.67,57.12 | R8.2 15.31,16.77 16.32,17.78 25.34,17.78 v28.32,20.77
  Top 0.61: v26.86,53.28 26.86,54.04 24.83,56.07 24.83,62.55 27.56,65.28 32.77,65.28 | 32.77,65.28 37.94,65.35 v37.91,65.41 | 32.83,65.34 32.77,65.28
  Bottom 0.254: v15.05,33.91 15.12,34.05 C13.2 | C12.2 18.66,33.98 18.7,33.94 | v18.16,32.13 18.16,33.4 18.35,33.59 18.7,33.94 | 18.7,33.94 arc-90 18.67,33.97 v18.67,34.42
  Bottom 0.305: 21.97,29.01 C15.2 v21.91,28.26 22.67,28.26 29.27,21.65 v37.15,21.65 | C14.2 21.92,34.1 v23.3,34.1 23.3,36.07 24.7,37.47 29.97,37.47 30.86,38.35 v30.86,40.77 | v18.54,37.02 18.54,35.93 C12.2 | v42.04,48.13 42.04,47.18 42.48,46.74 44.34,46.74 R15.2 R14.2 R6.2 42.42,41.08 41.62,40.28 38.1,40.28 37.82,40.56 34.75,40.56 33.98,41.33 33.98,41.43 | v30.86,40.77 31.32,40.31 32.87,40.31 33.98,41.43 | 29.02,53.21 26.92,53.21 v26.86,53.28 | C13.2 17.9,34.05 18.35,33.59 | v46.61,62.99 46.61,64.52 45.66,65.47 39,65.46 v37.91,65.41 | R16.2 22.16,46.48 22.99,46.48 23.27,46.2 23.27,45.54 23.39,45.41 23.93,45.41 24.18,45.16 24.18,44.09 | 24.18,44.09 24.18,42.8 26.21,40.77 v30.86,40.77 | R5.2 24.13,44.04 24.18,44.09 | R21.2 36.17,42.51 R17.2 34.11,41.55 33.98,41.43
  Bottom 0.406: U2.37 3.91,27.27 2.92,28.26 2.92,35.88 3.37,36.32 12.64,36.32 v15.05,33.91 | v28.32,20.77 28.38,20.77 29.27,21.65
  Bottom 0.61: 3.3V_REG.4 29.78,53.97 29.02,53.21 24.9,53.21 C28.1 | v37.91,65.41 40.27,65.48
+5V  (via drill 0.33, 0.5, 0.6)  (1 unrouted)
  Top 0.254: LIDAR.1 36.77,2.6 33.85,5.52 33.85,8.95 34.48,9.59 34.48,11.94 | R19.2 36.13,6.67 36.13,4.7 36.45,4.38 37.78,4.38 38.04,4.13 LIDAR.1 | R18.2 46.55,6.29 46.55,5.27 47.18,4.64 47.18,1.65 46.55,1.02 38.54,1.02 38.04,1.52 LIDAR.1
  Top 0.305: 34.48,11.94 32.67,13.75 30.42,13.75 | v38.89,62.33 38.89,63.7 39.93,64.75 39.93,66.14 38.99,67.08 35.89,67.08 35.36,67.61 35.36,68.89 SERVO1.2
  Top 0.406: 30.42,11.74 U3.6
  Top 0.61: 7.11,60.98 7.26,61.14 10.21,61.14 10.69,61.62 10.69,63.22 10.01,63.91 10.01,66.57 10.59,67.16 13.03,67.16 13.54,67.67 13.54,69.72 14.78,70.97 33.3,70.97 SERVO1.2 37.49,71.02 43.28,71.02 44.2,70.1 SERVO2.2
  Top 0.813: JP2.5 27.05,2.92 | U$2.9 6.56,8.38 6.56,8.09 | 6.22,7.75 5.97,7.49 | 30.42,11.74 v30.42,14.1
  Top 1.016: 27.05,2.92 24.38,5.59 15.88,5.59 10.54,10.92 8.23,10.92 U$2.9 | 6.56,8.09 6.22,7.75 9.14,7.75 13.08,3.81 JP3.5 | 5.97,7.49 JP1.5
  Top 1.676: v10.92,53.09 7.11,56.9 7.11,60.98 7.11,65.28 6.22,66.17 2.67,66.17 1.65,65.15 1.65,23.69 5.21,20.13 5.21,16.19 6.56,14.84 6.56,8.38
  Bottom 0.305: R3.1 38.08,61.52 v38.89,62.33 38.91,62.36 42.67,62.36 43.48,61.54 R22.1
  Bottom 0.406: TOUCHSCREEN.2 34.16,12.26 32.32,14.1 v30.42,14.1 | U$1.9 25.03,11
  Bottom 0.61: C9.1 10.1,53.91 v10.92,53.09
  Bottom 0.813: U$2.9 6.56,8.09 5.97,7.49 JP1.5 | U$1.9 25.03,4.56 JP2.5 | JP3.5 13.08,2.03 | 25.03,11 28.13,14.1 v30.42,14.1
  Bottom 1.27: U1.4 15.75,55.06 15.75,53.98
  Bottom 1.676: 15.75,53.98 14.86,53.09 v10.92,53.09
GND  (via drill 0.33, 0.5, 0.6)
  Top 0.254: PIC32.20 21.69,40.36 21.91,40.58 22.79,40.58 C16.1 | PIC32.41 v15.05,32.38 | v12.45,46.93 17.59,52.07 v17.59,53.15 | 38.48,17.27 38.48,17.84 PIC_PROG1.3
  Top 0.305: POWER.C 11.08,70.23 9.21,70.23 8.51,69.53 8.51,69.03 7.81,68.33 5.54,68.33 VIN.1 | PIC32.9 23.88,32.89 v23.3,32.32 | PIC32.20 21.69,37.5 21.4,37.21 21.34,37.21 | 21.34,37.21 19.37,37.21 19.18,37.4 PIC32.25 | v21.65,36.01 21.65,36.89 21.34,37.21 | PIC32.41 11.37,32.38 11.05,32.07 11.05,29.46 9.84,28.26 8.58,28.26 C18.1 6.35,28.26 5.59,29.02 5.59,33.47 6.1,33.97 ECS-240-20-33-TR1.2 ECS-240-20-33-TR1.4 | C17.2 8.07,36.27 6.86,35.05 6.86,34.1 ECS-240-20-33-TR1.2 | 38.48,17.27 38.48,15.56 38.99,15.05 42.93,15.05 43.43,14.54 TOUCHSCREEN.6 | v31.56,64.2 31.56,63.37 | 31.56,63.31 31.56,62.87 31.37,62.67 31.37,63.18 31.56,63.37 | 31.56,63.37 31.56,63.31 | 31.56,63.31 31.5,63.25 v31.5,61.09 | v28.45,61.09 v31.5,61.09 | v31.43,58.17 31.43,61.02 v31.5,61.09 | v34.42,61.09 v31.5,61.09 | v22.99,42.16 22.99,40.78 C16.1
  Top 0.406: 38.48,19.05 PIC_PROG1.3 | S1.1 24,15.49 v24,12.26 24,10.92 25.78,9.14 31.62,9.14 32.58,8.19 32.58,4.32 32.7,4.19 | C18.1 8.57,27.11 6.79,25.34 4.5,25.34 U2.39 | ECS-240-20-33-TR1.4 ECS-240-20-33-TR1.2
  Top 0.61: v44.01,63.37 46.74,66.1 SERVO2.1
  Top 0.813: LIDAR_MOTOR_OUTPUT.2 33.71,3.63 33.15,4.19 32.7,4.19 30.8,4.19 30.29,4.7 U3.3
  Bottom 0.254: v15.05,32.38 15.19,32.25 C13.1 16.83,31.3 17.14,30.99 18.09,30.99 C20.1 C21.1 21.78,31 C15.1 C14.1 | 21.92,32.32 21.14,32.32 20.45,33.02 20.45,35.8 C12.1 | C19.2 38.92,22.29 38.42,21.78 PIC_PROG1.3 | C7.2 16.62,45.91 14.1,45.91 13.08,46.93 v12.45,46.93 | v17.59,53.15 17.53,53.21 17.53,55.63
  Bottom 0.305: v23.3,32.32 21.92,32.32 C14.1 | C12.1 21.46,35.81 v21.65,36.01 | v17.53,64.14 U1.G 17.75,61.15 v20.51,61.15 | v17.46,58.17 17.46,60.33 18.1,60.96 | v14.48,61.15 17.46,61.15 v17.53,61.09 | I2C2.3 20.51,68.45 v20.51,64.14 | I2C1.3 29.15,64.77 v28.51,64.14 | C4.2 19.18,43.59 20.09,42.67 22.48,42.67 v22.99,42.16
  Bottom 0.406: U$1.8 25.03,13.29 v24,12.26 | TOUCHSCREEN.6 44.07,12.26 45.28,11.05 45.28,9.21 44.2,8.13 34.92,8.13 34.35,7.56 34.35,6.98 D2.A | LIDAR.4 44.32,1.02 35.17,1.02 LIDAR_MOTOR_OUTPUT.2 | v13.97,25.02 13.73,25.26 U2.39 | v27.75,27.69 23.3,32.13 v23.3,32.32 | v20.45,58.1 18.1,60.45 18.1,60.96 18.1,61.37 | v20.51,64.14 18.29,61.91 18.29,61.37 | v14.54,64.14 17.3,61.37 U1.G | v14.48,58.1 17.46,61.09 v17.53,61.09 | v28.51,64.14 31.27,61.37 3.3V_REG.G | v34.54,64.2 31.5,61.15 | 31.5,61.15 v31.5,61.09 v34.48,58.1 | v28.45,58.1 31.5,61.15 | 31.5,61.15 31.5,61.91
  Bottom 0.61: C3.1 34.41,8.81 D2.A | C4.2 C7.2 16.55,45.84 C5.C 12.97,44.71 D1.A | C9.2 11,56.78 12,57.78 13.94,57.78 U1.G | C28.2 24.89,60.99 24.51,61.37 | U$2.8 13.32,9.26 14.61,10.54 14.61,11.49 15.43,12.32 23.94,12.32 v24,12.26 | SERVO1.1 34.54,65.53 v34.54,64.2 | U2.2 43.99,63.39 v44.01,63.37
  Bottom 0.813: VIN.1 4.01,66.09 4.83,65.28 8.89,65.28 12.8,61.37 U1.G | U2.2 31.5,63.39 31.5,61.91 3.3V_REG.G | U$2.8 10.81,9.26 9.84,10.22 9.84,17.97 8.26,19.56 5.91,19.56 4.45,21.02 4.45,25.23 U2.39 | D2.A 33.71,6.22 LIDAR_MOTOR_OUTPUT.2
  Bottom 1.27: U1.3 17.53,55.63 v17.53,61.09 U1.G 18.1,61.37 18.29,61.37 24.51,61.37 3.3V_REG.G v31.5,61.09 3.3V_REG.3
  pour Bottom: 0.06,71.75 48.2,71.75 48.2,0.13 0.06,0.13
  pour Top: 0.06,71.75 48.2,71.75 48.2,0.13 0.06,0.13
LIDAR_MOTOR_OUTPUT
  Bottom 0.813: D2.C 27.6,6.92 F1.1
  Bottom 1.27: F1.1 27.56,5.73 LIDAR_MOTOR_OUTPUT.1
LIDAR_MOTORA_DRIVE
  Top 0.254: R4.2 MOTORA.C
  Top 0.305: R4.2 31.18,8.32 31.56,7.94 U3.4
M1A  (via drill 0.5)
  Top 0.254: PIC32.52 17.17,25.3 v16.76,24.89
  Bottom 0.254: v16.76,24.89 16.76,17.27 16.13,16.64 U$1.1
M1B  (via drill 0.5)
  Top 0.254: PIC32.53 17.68,23.9 v17.59,23.94
  Bottom 0.254: v17.59,23.94 17.59,15.24 U$1.2
M1C  (via drill 0.5)
  Top 0.254: PIC32.54 18.22,26.86 18.22,24.7 v18.67,24.26
  Bottom 0.254: U$1.3 18.73,15.12 18.67,15.18 v18.67,24.26 18.73,24.19
M1D  (via drill 0.5)
  Top 0.254: PIC32.55 18.67,25.78 19.18,25.27 v19.3,25.27
  Bottom 0.254: U$1.4 20,15.12 20,24.57 v19.3,25.27
M2A  (via drill 0.5)
  Top 0.254: PIC32.60 21.18,25.31 v20.7,24.83
  Bottom 0.254: v20.7,24.83 20.7,23.69 21.27,23.11 21.27,15.12 U$1.5
M2B  (via drill 0.5)
  Top 0.254: PIC32.61 21.72,26.87 v21.72,24.32
  Bottom 0.254: v21.72,24.32 22.49,23.55 U$1.6
M2C  (via drill 0.5)
  Top 0.254: PIC32.62 22.17,25.45 v22.67,24.96
  Bottom 0.254: v22.67,24.96 23.76,23.86 U$1.7
M2D  (via drill 0.5)
  Top 0.254: PIC32.63 22.68,26.02 23.5,25.21 23.5,24.19 22.48,23.18 14.92,23.18 v11.75,20
  Bottom 0.254: v11.75,20 11.75,18.16 U$2.1
M3A  (via drill 0.5)
  Top 0.254: v13.14,20.07 13.14,20.64 15.11,22.61 22.61,22.61 23.94,23.94 23.94,25.4 23.18,26.16 23.18,26.89 PIC32.64
  Bottom 0.254: U$2.2 13,16.88 13.72,17.59 13.72,19.49 v13.14,20.07
M3B  (via drill 0.5)
  Top 0.254: v14.1,20.45 14.1,20.83 15.37,22.1 22.73,22.1 24.45,23.81 24.45,28.16 PIC32.1
  Bottom 0.254: U$2.3 12.69,15.61 14.48,17.4 14.48,20.07 v14.1,20.45
M3C  (via drill 0.5)
  Top 0.254: v15.18,20.89 15.94,21.65 22.92,21.65 24.89,23.62 24.89,27.05 26.29,28.45 26.29,29.15 26.1,29.34 25.22,29.34 PIC32.2
  Bottom 0.254: U$2.4 13.19,14.34 13.46,14.61 13.46,15.68 14.92,17.14 14.92,20.64 v15.18,20.89
M3D  (via drill 0.5)
  Top 0.254: v15.81,19.94 15.81,20.51 16.45,21.14 23.05,21.14 25.34,23.43 25.34,26.8 26.92,28.38 26.92,29.46 26.48,29.91 25.18,29.91 PIC32.3
  Bottom 0.254: U$2.5 12.75,13.07 14.03,14.35 14.03,15.43 15.49,16.89 15.49,19.62 v15.81,19.94
N1
  Top 0.254: R10.2 34.67,47.45 30.02,42.8 21.46,42.8 20.68,42.01 PIC32.22
N2
  Top 0.254: R2.2 32.64,46.05 29.96,43.37 29.87,43.28 29.84,43.26 21.01,43.26 20.19,42.44 PIC32.23
N$1
  Top 0.254: U2.25 5.46,39.31 6.57,38.2 U$4.1
N$2
  Bottom 0.305: R25.2 45.59,26.54 ANALOG.1
N$3
  Bottom 0.305: R24.2 46.35,28.57 ANALOG.2
N$4  (via drill 0.5)
  Top 1.016: v33.4,10.1 33.4,10.99 32.7,11.68 31.63,11.68 U3.5
  Bottom 0.61: C3.2 33.9,10.1 v33.4,10.1
  Bottom 0.813: 27.71,9.65 F1.2
  Bottom 1.016: 27.71,9.65 32.96,9.65 v33.4,10.1
N$5
  Top 0.305: PIC32.46 12.56,29.9 12.06,29.4 12.06,21.53 10.79,20.26 10.79,19.56 11.11,19.24 11.11,11.75 14.54,8.32 R4.1
N$6  (via drill 0.5)
  Top 0.254: PIC32.14 30.79,35.38 v31.18,34.99
  Bottom 0.254: v31.18,34.99 34.73,34.99 34.8,35.05
  Bottom 0.305: 41.93,32.38 R20.1 42.1,32.64 41.78,32.32 39.62,32.32 36.89,35.05 34.8,35.05
N$7
  Top 0.254: U2.21 5.51,43.32 6.79,42.04 U$3.1
N$8
  Top 0.305: R18.1 43.34,6.67 UARTRX4.A
N$9
  Bottom 0.305: R23.2 46.23,30.61 ANALOG.3
N$10  (via drill 0.5)
  Top 0.254: PIC32.13 29.81,34.9 v30.29,34.42
  Bottom 0.254: v30.29,34.42 30.48,34.23 36.32,34.23 36.58,33.97
  Bottom 0.305: 36.58,33.97 37.15,33.97 39.24,31.88 39.24,30.92 39.81,30.35 41.21,30.35 41.74,30.35 41.93,30.35 R23.1
N$11
  Top 0.254: PIC32.39 11.24,33.4 | 11.24,33.4 10.54,33.4 9.96,33.98 ECS-240-20-33-TR1.1 | C17.1 11.24,34.34 11.24,33.4
N$12
  Top 0.254: PIC32.40 10.92,32.89 10.41,32.38 10.41,31.5 9.97,31.05 8.57,31.05 | 8.57,31.05 7.43,31.05 6.98,31.5 ECS-240-20-33-TR1.3 | C18.2 8.57,31.05
N$13  (via drill 0.5)
  Top 0.254: v29.02,34.16 28.79,34.39 PIC32.12
  Bottom 0.254: 36.96,32.96 35.69,32.96 34.99,33.66 29.53,33.66 v29.02,34.16
  Bottom 0.305: R24.1 41.8,28.19 39.88,28.19 38.67,29.4 38.67,31.56 37.27,32.96 36.96,32.96
N$14  (via drill 0.5)
  Top 0.254: PIC32.11 27.27,33.88 v27.75,33.4
  Bottom 0.254: 36.26,32.45 37.34,31.37 37.34,31.11
  Bottom 0.305: 36.26,32.45 35.5,32.45 34.8,33.15 28,33.15 v27.75,33.4 | R25.1 41.93,26.29 40.07,26.29 38.1,28.26 38.1,30.35 37.34,31.11
N$15
  Bottom 0.305: R20.2 45.97,32.64 ANALOG.4
N$16
  Top 0.254: PIC32.19 22.17,39.51 22.42,39.75 24.51,39.75 24.64,39.88 24.64,40.63 C16.2 26.43,40.64 R1.1
N$17  (via drill 0.5)
  Top 0.305: PIC32.56 v19.18,28.38
  Bottom 0.305: v19.18,28.38 19.18,28.96 | 19.18,28.96 18.21,28.96 C20.2 | C21.2 20.08,28.96 19.18,28.96
N$18  (via drill 0.33)
  Top 0.305: SERVO1.3 32.83,67.2 33.6,66.42 38.46,66.42 39.27,65.61 39.27,65 38,63.73 38,56.84 v38.02,56.82
  Bottom 0.305: Q1.3 36.81,48.8 38.02,50.01 v38.02,56.82 38.02,57.1 38.02,58.84 R3.2
N$19
  Top 0.305: PIC32.16 31.93,36.4 33.97,34.35 33.97,20.07 PIC_PROG1.4
N$20
  Top 0.254: R10.1 34.75,50.35 41.78,50.35 42.04,50.1 LED0.C
N$21  (via drill 0.6)
  Top 0.254: PIC32.8 24.26,32.38 24.07,32.19 24.07,31.88 23.75,31.56 21.84,31.56 19.81,33.59 18.29,33.59 17.84,34.04 17.84,36.7 17.65,36.89 v17.02,36.89 | v12.95,40.07 12.57,39.69 U$3.2
  Top 0.305: PIC32.8 30.86,32.38 31.24,32.77 32.19,32.77 32.7,32.26 32.7,21.59 31.81,20.7 31.81,16.7 32.58,15.94 36.2,15.94 37.97,14.16 40.45,14.16 40.89,13.72 TOUCHSCREEN.4
  Bottom 0.254: v17.02,36.89 13.97,40.07 v12.95,40.07
N$22
  Top 0.254: R2.1 34.69,52.32 41.97,52.32 42.35,51.94 LED1.C
N$23
  Top 0.305: R7.1 27.26,24.4 23.5,20.64 S1.3
N$24
  Top 0.254: R11.1 33.35,53.02 38.35,53.02 39.69,54.36 41.47,54.36 42.16,53.66 LED3.C
N$25  (via drill 0.33)
  Top 0.305: v41.86,60.27 41.86,68.76 SERVO2.3
  Bottom 0.305: Q2.3 36.91,47.65 39.6,50.34 41.05,50.34 43.48,52.78 R22.2 42.3,59.1 41.88,59.51 41.88,60.25 v41.86,60.27
N$26
  Bottom 0.305: Q1.1 26.1,44.33 25.83,44.07 25.18,44.07 R5.1
N$27
  Bottom 0.305: R21.1 37.86,42.82 Q2.1
N$28
  Top 0.305: 28.85,50.29 28.85,50.34
N$29  (via drill 0.5)
  Top 0.305: PIC32.49 15.67,27.86 15.68,27.88 v15.68,28.96 | UARTRX4.C 43.05,2.67 LIDAR.3
  Bottom 0.305: LIDAR.3 43.12,5.91 43.62,6.41 44.32,6.41 46.74,8.83 46.74,13.08 44.2,15.62 31.62,15.62 26.23,21.02 26.23,23.94 23.37,26.8 17.02,26.8 16.26,27.56 16.26,28.38 v15.68,28.96
N$30  (via drill 0.5)
  Top 0.305: PIC32.43 14.9,31.39 15.3,30.99 15.3,30.23 v15.05,29.97 | UARTTX4.C 40.45,2.48 LIDAR.2
  Bottom 0.305: LIDAR.2 40.58,6.16 41.59,7.18 44.26,7.18 46.1,9.02 46.1,12.83 43.81,15.11 31.3,15.11 25.72,20.7 25.72,23.62 23.11,26.23 16.26,26.23 14.61,27.88 14.61,29.53 v15.05,29.97
N$31
  Top 0.254: MOTORA.A 17.24,12.61 R8.1
N$33
  Top 0.254: PIC32.24 19.68,42.61 20.83,43.75 29.65,43.75 30.61,44.7 R11.2
N$36  (via drill 0.33)
  Top 0.305: PIC32.17 32.17,38.38 32.54,38.01 32.54,36.8 35.05,34.29 41.3,34.29 41.96,34.95 v41.96,36.32
  Bottom 0.305: v41.96,36.32 42.18,36.1 R26.1
N$37
  Bottom 0.305: R26.2 45.21,34.67 ANALOG.5
N$38
  Top 0.305: 17.46,61.15 17.46,61.09
N$39
  Top 0.254: U2.9 7.66,52.12 U$6.2
N$40  (via drill 0.33, 0.6)
  Top 0.254: PIC32.21 21.18,41 v21.65,41.47 | U$5.1 9.16,43.14 v9.96,42.34
  Bottom 0.305: v21.65,41.47 21.01,42.11 10.19,42.11 v9.96,42.34
N$43
  Top 0.305: UARTTX4.A 38.07,6.96 R19.1
N$48
  Bottom 1.27: F4.2 7.11,69.65 VIN.2
N$50  (via drill 0.5)
  Top 0.305: v9.21,62.55 9.21,68.17 POWER.A
  Bottom 0.305: R39.2 10.1,61.66 v9.21,62.55
N$51
  Bottom 0.813: U$1.16 16.14,8.65 15.62,8.13 11.18,8.13 9.02,5.97 6.48,5.97 JP3.1
N$52
  Bottom 0.813: U$1.15 17.41,8.14 16.26,6.99 11.94,6.99 9.78,4.83 8.13,4.83 JP3.2
N$53
  Bottom 0.813: U$1.14 18.68,7.76 16.64,5.71 12.19,5.71 10.16,3.68 9.27,3.68 JP3.3
N$54
  Bottom 0.813: U$1.13 19.95,7.51 16.89,4.45 12.83,4.45 JP3.4
N$55
  Bottom 0.813: U$1.12 21.22,6.87 JP2.1
N$56
  Bottom 0.813: U$1.11 22.49,5.35 JP2.2
N$57
  Bottom 0.813: U$1.10 23.75,9.85 23.75,4.06 22.23,2.54 JP2.3
N$58  (via drill 0.5)
  Top 0.813: JP2.4 24.51,3.05 23.5,4.06 14.86,4.06 9.84,9.08 v8.76,9.08
  Bottom 0.813: 8.83,17.21 8.76,17.27 | 8.76,17.27 8,18.03 6.68,18.03 U$2.16 | v8.76,9.08 8.76,17.27
N$59
  Bottom 0.813: U$2.15 3.7,16.88 JP1.1
N$60
  Bottom 0.813: U$2.14 3.16,15.61 JP1.2
N$61
  Bottom 0.813: U$2.13 4.68,14.34 JP1.3
N$62
  Bottom 0.813: U$2.12 5.32,13.07 4.83,12.57 4.83,10.79 4.06,10.03 JP1.4
N$63
  Top 0.254: U2.5 5.52,58.27 5.52,55.75 9.16,52.12 U$5.2
N$64
  Top 0.254: 15.94,33.97 15.94,34.35 14.92,35.37 14.92,36.7 14.86,36.77
  Top 0.305: PIC32.50 16.18,28.18 16.51,28.51 16.51,29.34 15.94,29.91 15.94,33.97 | 14.86,36.77 14.54,37.08 14.54,44.2 22.42,52.07 22.42,65.85 21.97,66.29 17.59,66.29 I2C2.1
N$65
  Top 0.254: 16.51,34.1 16.51,34.54 15.43,35.62 15.43,37.15 15.37,37.21
  Top 0.305: PIC32.51 16.69,27.8 17.08,28.19 17.08,29.72 16.51,30.29 16.51,34.1 | 15.37,37.21 15.11,37.47 15.11,43.88 22.92,51.69 22.92,66.23 22.29,66.86 18.35,66.86 17.65,67.56 I2C2.2
N$66  (via drill 0.33, 0.6)
  Top 0.254: PIC32.29 17.17,41.05 v17.4,41.27 | U$6.1 7.66,42.76 v8.97,41.45
  Bottom 0.254: 17.14,41.4 v17.4,41.27 17.22,41.45 v8.97,41.45
N$67
  Top 0.254: WLAN.C 42.77,41.08 U2.22
N$68
  Top 0.254: LED6.C 41.8,44.07 U2.20
N$69
  Top 0.254: LED7.C 41.13,46.74 U2.18
N$70  (via drill 0.5)
  Top 0.254: LED7.A 46.45,45.37 v46.42,45.34
  Bottom 0.254: v46.42,45.34 46.42,46.66 R15.1
N$71  (via drill 0.5)
  Top 0.254: LED6.A 46.45,42.58 v46.42,42.55
  Bottom 0.254: v46.42,42.55 46.42,43.99 R14.1
N$72  (via drill 0.5)
  Top 0.254: WLAN.A 46.45,39.78 v46.42,39.75
  Bottom 0.254: v46.42,39.75 46.42,41.07 R6.1
ONE
  Top 0.305: R13.1 26.54,50.55 30.33,54.33 37.19,54.33 39.32,56.46 39.32,57.68 39.9,58.34 41.15,58.34 42.34,57.07 44.53,57.07 LED5.C
PIC_HANG_CHK
  Top 0.305: PIC_PROG1.5 33.34,33.91 31.37,35.88 31.11,35.88 31.1,35.89 PIC32.15
PICUART_RX  (via drill 0.5)
  Top 0.305: PIC32.31 16.18,42.98 23.94,50.74 23.94,63.63 25.34,65.02 v25.34,65.22
  Bottom 0.305: I2C1.1 24.07,66.61 25.34,65.34 v25.34,65.22
PICUART_TX
  Top 0.305: PIC32.32 15.67,43.29 23.43,51.05 23.43,65.15 26.61,68.33 I2C1.2
SCK2
  Top 0.305: TOUCHSCREEN.1 36.39,9.72 35.05,11.05 35.05,13.84 34.54,14.35 31.62,14.35 30.23,15.75 30.23,21.4 31.18,22.35 31.18,29.34 30.16,30.35 25.2,30.35 PIC32.4
SDI2  (via drill 0.5)
  Top 0.305: PIC32.5 25.2,30.86 30.42,30.86 31.69,29.59 31.69,22.1 30.73,21.14 30.73,16.38 32.26,14.86 35.31,14.86 36.07,14.1 v36.07,11.24
  Bottom 0.305: TOUCHSCREEN.3 40.89,10.67 40.58,10.99 36.32,10.99 v36.07,11.24
SDO2  (via drill 0.6)
  Top 0.254: PIC32.6 24.28,31.39 23.94,31.05 21.4,31.05 19.43,33.02 17.53,33.02 16.95,33.59 16.95,35.24 v16.57,35.62 | v12.45,37.59 12.06,37.97 8.04,37.97 U$4.2
  Top 0.305: TOUCHSCREEN.5 42.16,10.99 37.02,10.99 37.02,14.22 35.88,15.37 32.45,15.37 31.3,16.51 31.3,20.95 32.19,21.84 32.19,29.84 30.67,31.37 25.2,31.37 PIC32.6
  Bottom 0.254: v16.57,35.62 14.61,37.59 v12.45,37.59
SERV1  (via drill 0.33)
  Top 0.254: R13.2 26.54,45.66 25.59,44.7 24.87,44.7 20.38,44.7 18.41,42.74 18.41,40.64 17.65,39.88 17.65,38.41 PIC32.28
  Top 0.305: v24.89,45.34 24.87,45.31 24.87,44.7
  Bottom 0.305: v24.89,45.34 24.89,45.91 Q1.2 24.11,46.69 24.11,48.06 23.77,48.4 R16.1
SERV2  (via drill 0.33)
  Top 0.254: v28.57,45.02 27.75,44.2 20.57,44.2 18.92,42.55 18.92,40.39 18.16,39.62 18.16,38.41 PIC32.27 | 28.57,45.09 R12.2
  Top 0.305: v28.57,45.02 28.57,45.09
  Bottom 0.305: R17.1 35.41,44.51 Q2.2 35.41,44.5 29.1,44.5 v28.57,45.02
TWO
  Top 0.305: R12.1 28.57,51.23 31.04,53.7 37.49,53.7 40.11,56.31 41.05,56.31 42.06,55.3 44.47,55.3 LED4.C
VCC
  Bottom 0.305: R39.1 7.45,58.94 7.11,58.61
  Bottom 0.61: C5.A 14.1,51.18 | C7.1 17.21,48.5 17.21,51.18 | C4.1 19.18,51.18
  Bottom 0.813: D1.C 10.29,51.18
  Bottom 1.27: F4.1 7.11,58.61 7.11,53.47 9.4,51.18 10.29,51.18 14.1,51.18 17.21,51.18 18.8,51.18 | 18.8,51.18 19.43,51.82 19.43,54.93 | 19.43,54.93 U1.2 | 19.43,54.93 20.78,54.93 U1.1 | 3.3V_REG.1 3.3V_REG.2 33.22,52.65 31.75,51.18 19.18,51.18 18.8,51.18

### Text on the board
tPlace: MCLR